# Altium schematic sheet Connecors-Input.SchDoc: =ProjectDescription
size 420 x 297 mm; Address1: Address1; Address2: Address2; Address3: Address3; Address4: Address4; SheetNumber: 1; SheetTotal: 3; Scale: 1:1; DocumentType: Схема электрическая принципиальная
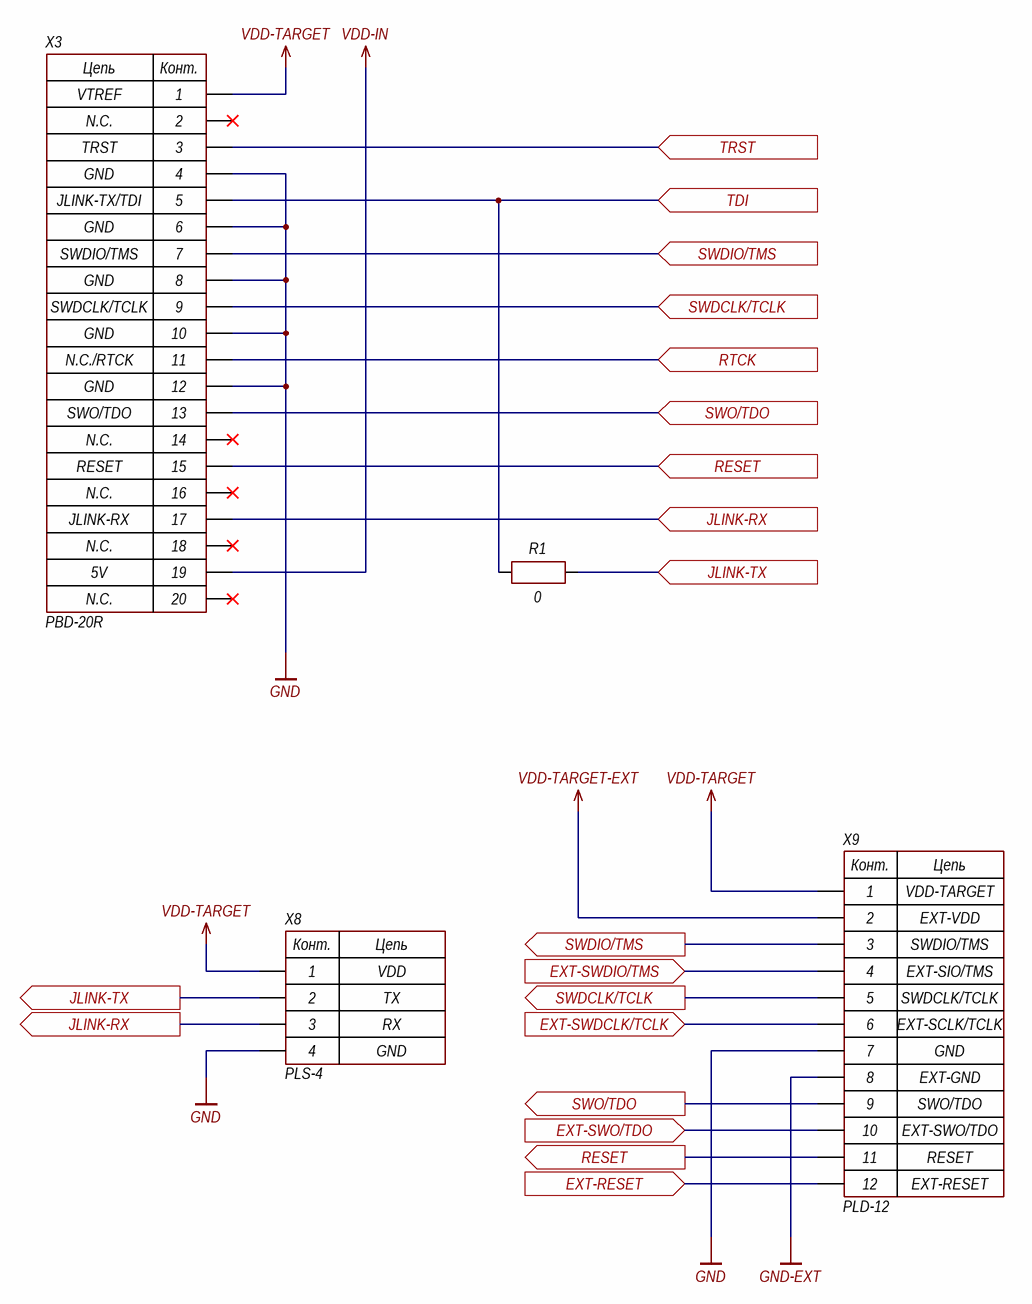
[diagram p0: Connecors-Input.SchDoc]

## Parts
R1  0  [CH0402R]
X3  PBD-20R  [CON: PBD-20R]
X8  PLS-4  [CON: PLS-4]
X9  PLD-12  [CON: PLD-12]

## Ports
EXT-RESET (in), EXT-SWDCLK/TCLK (in), EXT-SWDIO/TMS (in), EXT-SWO/TDO (in), JLINK-RX (in), JLINK-RX (out), JLINK-TX (in), JLINK-TX (out), RESET (in), RESET (out), RTCK (in), SWDCLK/TCLK (in), SWDCLK/TCLK (out), SWDIO/TMS (in), SWDIO/TMS (out), SWO/TDO (in), SWO/TDO (out), TDI (in), TRST (in)

## Nets
GND: X3.4 X3.6 X3.8 X3.10 X3.12 X8.4 X9.7
GND-EXT: X9.8
VDD-IN: X3.19
VDD-TARGET: X3.1 X8.1 X9.1
VDD-TARGET-EXT: X9.2
EXT-RESET: X9.12 ; port EXT-RESET
EXT-SWDCLK/TCLK: X9.6 ; port EXT-SWDCLK/TCLK
EXT-SWDIO/TMS: X9.4 ; port EXT-SWDIO/TMS
EXT-SWO/TDO: X9.10 ; port EXT-SWO/TDO
JLINK-RX: X3.17 X8.3 ; port JLINK-RX
JLINK-TX: R1.2 X8.2 ; port JLINK-TX
RESET: X3.15 X9.11 ; port RESET
RTCK: X3.11 ; port RTCK
SWDCLK/TCLK: X3.9 X9.5 ; port SWDCLK/TCLK
SWDIO/TMS: X3.7 X9.3 ; port SWDIO/TMS
SWO/TDO: X3.13 X9.9 ; port SWO/TDO
TDI: R1.1 X3.5 ; port TDI
TRST: X3.3 ; port TRST

Not connected (* = marked no-connect by the designer): X3 2* 14* 16* 18* 20*

## Notes on the sheet
- VTREF
- N.C.
- TRST
- GND
- JLINK-TX/TDI
- SWDIO/TMS
- SWDCLK/TCLK
- N.C./RTCK
- SWO/TDO
- JLINK-RX
- RESET
- 5V
- EXT-VDD
- VDD-TARGET
- VDD
- EXT-SIO/TMS
- TX
- RX
- (near X9) EXT-SCLK/TCLK
- EXT-SWO/TDO
- EXT-GND
- EXT-RESET
- Разраб.
- Изм.
- Лист
- № докум.
- Подп.
- Дата
- Лит.
- Масса
- Масштаб
- Пров.
- Т.контр.
- Листов
- Утв.
- Н.контр.
- 2.106-A3
- Копировал
- Формат А3
- (in symbol 4-Connector) Конт.; Цепь
- (in symbol 12-Connector) Конт.; Цепь
- (in symbol 20-Connector) Цепь; Конт.

## Library data of the parts
R1 = Resistor: Manufacturer: *; Model: *; HelpURL: *; ComponentKind: *; Value: 0; ClassName: JLINK-CONNECTOR
X3 = 20-Connector: Model: PBD-20R; Manufacturer: *; HelpURL: *; ComponentKind: *; ClassName: JLINK-CONNECTOR
X8 = 4-Connector: Model: PLS-4; Manufacturer: *; HelpURL: *; ComponentKind: *; ClassName: *
X9 = 12-Connector: Model: PLD-12; Manufacturer: *; HelpURL: *; ComponentKind: *